# EAGLE design breakout_green (EAGLE 8.0.2)
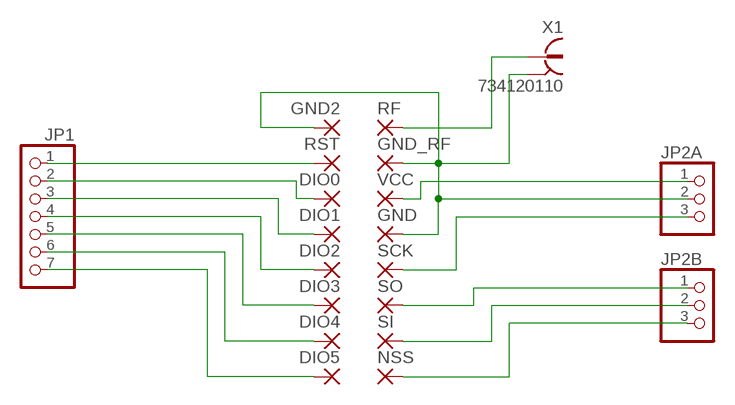
[diagram p0: schematic, sheet 1]

## Parts
DIO0  SMD2  [SMD1,27-2,54]
DIO1  SMD2  [SMD1,27-2,54]
DIO2  SMD2  [SMD1,27-2,54]
DIO3  SMD2  [SMD1,27-2,54]
DIO4  SMD2  [SMD1,27-2,54]
DIO5  SMD2  [SMD1,27-2,54]
GND  SMD2  [SMD1,27-2,54]
GND2  SMD2  [SMD1,27-2,54]
GND_RF  SMD2  [SMD1,27-2,54]
JP1  PINHD-1X7  [1X07]
JP2A  PINHD-1X3  [1X03]
JP2B  PINHD-1X3  [1X03]
NSS  SMD2  [SMD1,27-2,54]
RF  SMD2  [SMD1,27-2,54]
RST  SMD2  [SMD1,27-2,54]
SCK  SMD2  [SMD1,27-2,54]
SI  SMD2  [SMD1,27-2,54]
SO  SMD2  [SMD1,27-2,54]
VCC  SMD2  [SMD1,27-2,54]
X1  734120110  [734120110]

## Nets
3.3V: JP2A.1 VCC.1(P)
ANT: RF.1(P) X1.1
DIO0: DIO0.1(P) JP1.2
DIO1: DIO1.1(P) JP1.3
DIO2: DIO2.1(P) JP1.4
DIO3: DIO3.1(P) JP1.5
DIO4: DIO4.1(P) JP1.6
DIO5: DIO5.1(P) JP1.7
GND: GND2.1(P) GND.1(P) GND_RF.1(P) JP2A.2 X1.S@1 X1.S@2 X1.S@3
MISO: JP2B.1 SO.1(P)
MOSI: JP2B.2 SI.1(P)
NSS: JP2B.3 NSS.1(P)
RESET: JP1.1 RST.1(P)
SCK: JP2A.3 SCK.1(P)

## Library data of the parts
DIO0 DIO1-DIO5 GND GND2 GND_RF NSS RF RST SCK SI SO VCC = wirepad:SMD2: SMD PAD
JP1 = pinhead:PINHD-1X7: PIN HEADER
JP2A JP2B = pinhead:PINHD-1X3: PIN HEADER
X1 = con-coax:734120110: MICRO COAXIAL CONNECTOR RECEPTACLE VERTICAL Source: Data sheet <http://www.molex.com/pdm_docs/sd/734120110_sd.pdf>

## Board
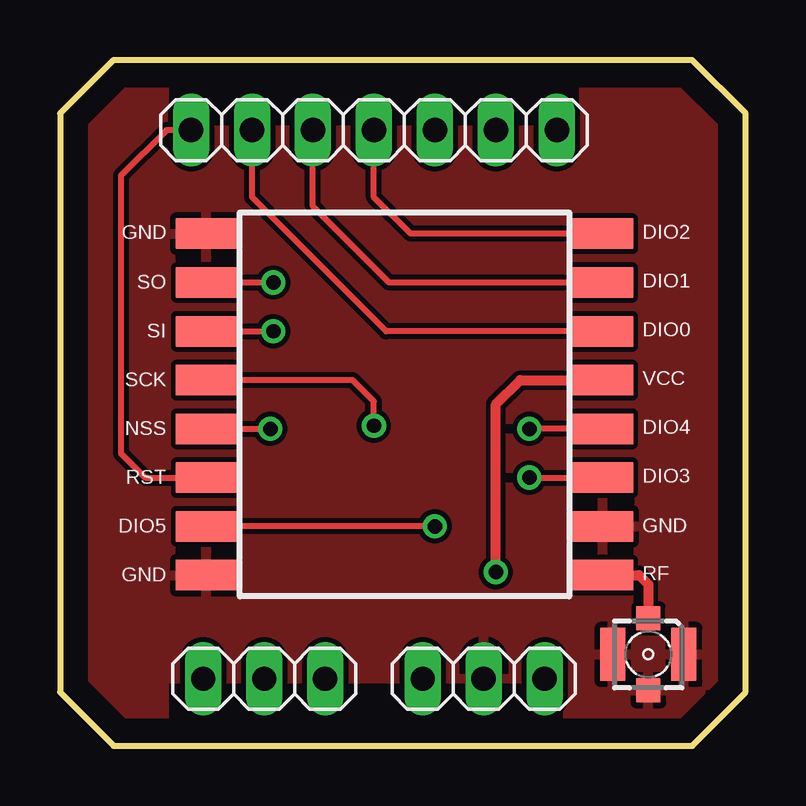
[diagram p1: board, top side]
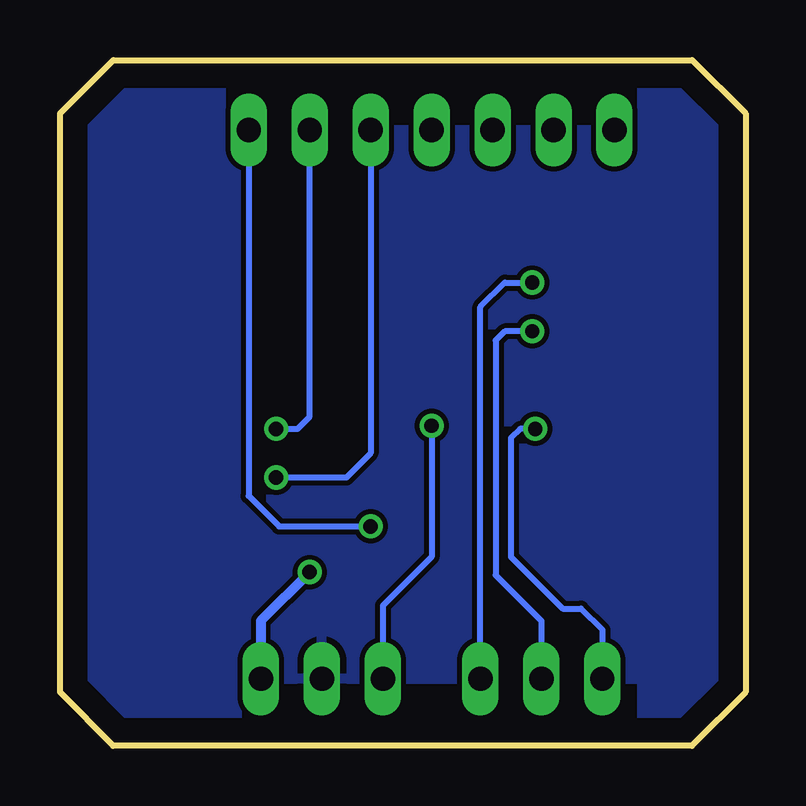
[diagram p2: board, bottom side, seen from below]

Size 28.57 x 28.57 mm. Coordinates in mm from the lower left corner, seen from the top.
Outline: 0,26.35 0,2.23 2.23,0 26.35,0 28.57,2.23 28.57,26.35 26.34,28.57 2.22,28.57 0,26.35
Copper layers (1*16): Top 0.035mm / dielectric 1.5mm / Bottom 0.035mm
Design rules "default *": minimum track width 10mil, minimum drill 0.6mm, track to track 8mil, track to pad 8mil, pad to pad 8mil, via to via 8mil, smd to smd 8mil, copper to edge 40mil, drill to drill 8mil, minimum pad ring 10mil, minimum via ring 8mil, stop-mask expansion 4mil, vias tented up to drill 0mil, thermal gap 10mil

### Footprints (pad centres in the part's own frame; a part is rotated, then mirrored left to right if it is on the bottom)
SMD1,27-2,54 = smd 1.27 x 2.54: 1 0,0
1X07 = drill 1.016 long: 1 -7.62,0; 2 -5.08,0; 3 -2.54,0; 4 0,0; 5 2.54,0; 6 5.08,0; 7 7.62,0
1X03 = drill 1.016 long: 1 -2.54,0; 2 0,0; 3 2.54,0
734120110 = smd 1 x 1: 1 0,-1.5; S@1 0,1.5 | smd 1.05 x 2.2: S@2 -1.475,0; S@3 1.475,0

### Placement (x,y rotation side)
DIO0  22.61,17.27 270 top
DIO1  22.61,19.3 270 top
DIO2  22.61,21.34 270 top
DIO3  22.61,11.18 270 top
DIO4  22.61,13.21 270 top
DIO5  6.1,9.14 90 top
GND  6.1,7.11 90 top
GND2  6.1,21.34 270 top
GND_RF  22.61,9.14 90 top
JP1  13.08,25.65 0 top
JP2A  17.65,2.79 180 top
JP2B  8.51,2.79 180 top
NSS  6.1,13.21 90 top
RF  22.61,7.11 270 top
RST  6.1,11.18 90 top
SCK  6.1,15.24 90 top
SI  6.1,17.27 90 top
SO  6.1,19.3 90 top
VCC  22.61,15.24 270 top
X1  24.51,3.81 180 top

### Tracks (layer width: path | path; a pad name or v marks a point on that pad's centre or on a via)
3.3V  (via drill 0.6)
  Top 0.406: v18.16,7.24 18.16,14.22 19.18,15.24 VCC.1
  Bottom 0.406: v18.16,7.24 20.19,5.21 JP2A.1
ANT
  Top 0.406: RF.1 24.13,7.11 24.51,6.73 X1.1
DIO0
  Top 0.254: DIO0.1 13.59,17.27 8,22.86 JP1.2
DIO1
  Top 0.254: DIO1.1 13.72,19.3 10.54,22.48 JP1.3
DIO2
  Top 0.254: DIO2.1 14.61,21.34 13.08,22.86 JP1.4
DIO3  (via drill 0.6)
  Top 0.254: v19.56,11.18 DIO3.1
  Bottom 0.254: JP1.5 15.62,12.19 16.64,11.18 v19.56,11.18
DIO4  (via drill 0.6)
  Top 0.254: DIO4.1 v19.56,13.21
  Bottom 0.254: v19.56,13.21 18.67,13.21 18.16,13.72 JP1.6
DIO5  (via drill 0.6)
  Top 0.254: v15.62,9.14 DIO5.1
  Bottom 0.254: JP1.7 20.7,10.41 19.43,9.14 v15.62,9.14
GND
  pour Top: 1.65,29.46 4.32,29.46 4.32,25.65 21.84,25.65 21.84,29.46 26.8,29.46 29.46,26.8 29.46,1.65 26.92,-0.89 19.3,-0.89 19.3,2.79 4.32,2.79 4.32,-0.89 1.78,-0.89 -0.89,1.78 -0.89,26.92
  pour Bottom: 1.91,29.08 4.32,29.08 4.32,25.65 21.84,25.65 21.84,29.08 26.54,29.08 29.08,26.54 29.08,1.91 26.67,-0.51 19.3,-0.51 19.3,2.79 4.32,2.79 4.32,-0.51 2.03,-0.51 -0.51,2.03 -0.51,26.67
MISO  (via drill 0.6)
  Top 0.254: v8.89,19.3 SO.1
  Bottom 0.254: JP2B.1 11.05,18.29 10.03,19.3 v8.89,19.3
MOSI  (via drill 0.6)
  Top 0.254: SI.1 v8.89,17.27
  Bottom 0.254: v8.89,17.27 10.03,17.27 10.41,16.89 10.41,7.11 8.51,5.21 JP2B.2
NSS  (via drill 0.6)
  Top 0.254: NSS.1 v8.76,13.21
  Bottom 0.254: v8.76,13.21 9.4,13.21 9.78,12.83 9.78,7.87 7.62,5.71 6.86,5.71 5.97,4.83 JP2B.3
RESET
  Top 0.254: JP1.1 4.45,25.65 2.54,23.75 2.54,12.19 3.56,11.18 RST.1
SCK  (via drill 0.6)
  Top 0.254: v13.08,13.34 13.08,14.35 12.19,15.24 SCK.1
  Bottom 0.254: v13.08,13.34 13.08,7.87 15.11,5.84 JP2A.3

### Text on the board
tNames: GND | GND